# Altium schematic sheet Sensors.SchDoc
size A3
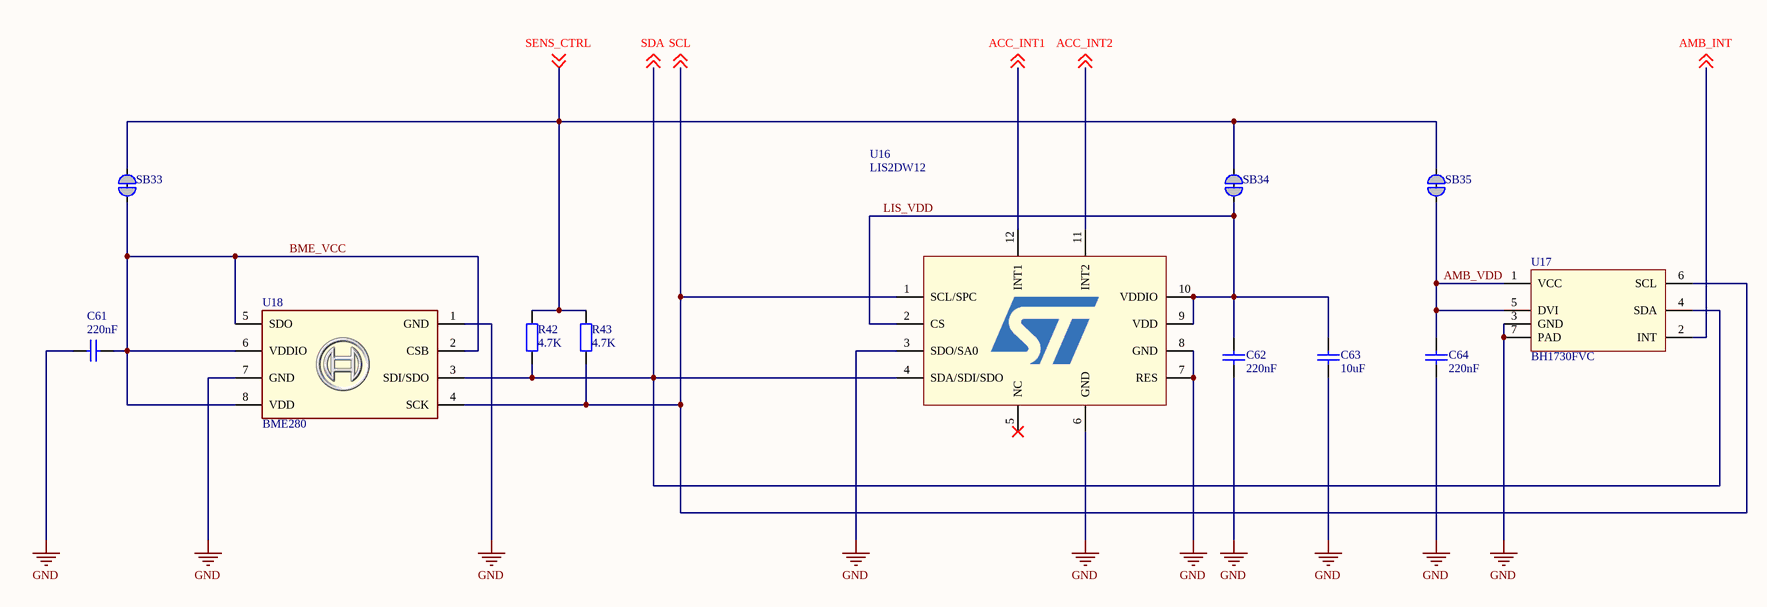
[diagram p0: Sensors.SchDoc]

## Parts
C61  value 220nF  [C0402]  (hidden comment: Cap Semi)
C62  value 220nF  [C0402]  (hidden comment: Cap Semi)
C63  value 10uF  [C0402]  (hidden comment: Cap Semi)
C64  value 220nF  [C0402]  (hidden comment: Cap Semi)
R42  value 4.7K  [R0402]  (hidden comment: Res2)
R43  value 4.7K  [R0402]  (hidden comment: Res2)
SB33  Solderbridge  [Solderbridge_Shorted]  (value not drawn)  (net tie, no BOM)
SB34  Solderbridge  [Solderbridge_Shorted]  (value not drawn)  (net tie, no BOM)
SB35  Solderbridge  [Solderbridge_Shorted]  (value not drawn)  (net tie, no BOM)
U16  LIS2DW12  [LGA-12 package]
U17  BH1730FVC  [WSOF6]
U18  BME280  [BME280]

## Nets
GND: C61.2 C62.2 C63.2 C64.2 U16.3(SDO/SA0) U16.6(GND) U16.7(RES) U16.8(GND) U17.3(GND) U17.7(PAD) U18.1(GND) U18.7(GND)
ACC_INT1: U16.12(INT1) ; off-sheet ACC_INT1
ACC_INT2: U16.11(INT2) ; off-sheet ACC_INT2
AMB_INT: U17.2(INT) ; off-sheet AMB_INT
AMB_VDD: C64.1 SB35.2 U17.1(VCC) U17.5(DVI)
BME_VCC: C61.1 SB33.2 U18.2(CSB) U18.5(SDO) U18.6(VDDIO) U18.8(VDD)
LIS_VDD: C62.1 C63.1 SB34.2 U16.2(CS) U16.9(VDD) U16.10(VDDIO)
SCL: R43.2 U16.1(SCL/SPC) U17.6(SCL) U18.4(SCK) ; off-sheet SCL
SDA: R42.2 U16.4(SDA/SDI/SDO) U17.4(SDA) U18.3(SDI/SDO) ; off-sheet SDA
SENS_CTRL: R42.1 R43.1 SB33.1 SB34.1 SB35.1 ; off-sheet SENS_CTRL

Not connected (* = marked no-connect by the designer): U16 5(NC)*

## Library data of the parts
C61-C64 = Cap Semi: Capacitor (Semiconductor SIM Model); Manufacturer: YAGEO; Manufacturer Part No.: CC0402KRX5R5BB224; Part Description: Ceramic Capacitor; Specification: X5R, 6.3V, 10%; Supplier: Rutronik; Supplier part number: KKK23148; Link: https://www.rutronik24.com/product/yageo/cc0402krx5r5bb224/3611951.html
R42 R43 = Res2: Manufacturer: ASJ; Manufacturer Part No.: CR10-472-JK; Part Description: Thick Film Resistor; Specification: 5% 0,063W; Supplier: Rutronik; Supplier part number: WRC41427; Link: https://www.rutronik24.com/product/asj/cr10-472-jk/54393.html
SB33-SB35 = Solderbridge Shorted: Manufacturer: *; Value: Solderbridge; Supplier: *; Supplier part number: *
U16 = LIS2DW12: MEMS digital output motion sensor: high-performance ultra-low-power 3-axis / "femto" accelerometer; Manufacturer: STMicroelectronics; Manufacturer Part No.: LIS2DW12TR; Specification: 1.62V, 3.6V, 2-8g; Value: LIS2DW12TR; Link: https://www.rutronik24.com/product/st/lis2dw12tr/8441777.html; Part Description: MEMS digital output motion sensor: high-performance ultra-low-power 3-axis  "femto" accelerometer; Supplier: Rutronik; Supplier part number: ICMEMS1297
U17 = BH1730FVC: Digital 16bit Serial Output Type Ambient Light Sensor IC; Manufacturer: ROHM; Manufacturer Part No.: BH1730FVC-TR; Specification: 2.4V, 3.6V, 100klx; Value: BH1730FVC-TR; Link: https://www.rutronik24.com/product/rohm/bh1730fvc-tr/5199695.html; Part Description: Digital 16bit Serial Output Type  Ambient Light Sensor IC; Supplier: Rutronik; Supplier part number: ICIN3260
U18 = BME280: Manufacturer: BOSH; Part Description: Pressure, Humidity, tempereture Sensor; Specification: I2C, SPI, 3.6uA; Manufacturer Part No.: BME280; Supplier: Rutronik; Supplier part number: ICIN3565; Value: BME280; Link: https://www.rutronik24.com/product/bosch+se/bme280/6440107.html